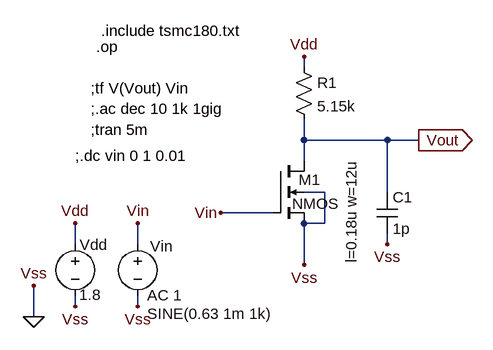
[diagram p0: schematic CS_amp.asc]
CS_amp.asc, the LTspice schematic file:
Version 4
SHEET 1 1056 680
WIRE 496 -64 496 -80
WIRE 496 48 496 16
WIRE 624 48 496 48
WIRE 672 48 624 48
WIRE 496 80 496 48
WIRE 528 128 496 128
WIRE 624 128 624 48
WIRE 448 160 368 160
WIRE 528 176 528 128
WIRE 528 176 496 176
WIRE 144 208 144 176
WIRE 240 208 240 176
WIRE 624 208 624 192
WIRE 496 240 496 176
WIRE 144 304 144 288
WIRE 240 304 240 288
WIRE 80 320 80 272
FLAG 80 320 0
FLAG 80 272 Vss
FLAG 240 176 Vin
FLAG 144 304 Vss
FLAG 240 304 Vss
FLAG 144 176 Vdd
FLAG 496 -80 Vdd
FLAG 496 240 Vss
FLAG 672 48 Vout
IOPIN 672 48 Out
FLAG 624 208 Vss
FLAG 368 160 Vin
SYMBOL nmos4 448 80 R0
WINDOW 0 40 29 Left 2
WINDOW 3 30 66 Left 2
WINDOW 123 121 -2 VRight 2
SYMATTR InstName M1
SYMATTR Value2 l=0.18u w=12u
SYMBOL voltage 144 192 R0
WINDOW 123 0 0 Left 0
WINDOW 39 0 0 Left 0
WINDOW 0 7 17 Left 2
WINDOW 3 6 94 Left 2
SYMATTR InstName Vdd
SYMATTR Value 1.8
SYMBOL voltage 240 192 R0
WINDOW 0 19 19 Left 2
WINDOW 3 15 123 Left 2
WINDOW 123 15 95 Left 2
WINDOW 39 0 0 Left 0
SYMATTR InstName Vin
SYMATTR Value SINE(0.63 1m 1k)
SYMATTR Value2 AC 1
SYMBOL res 480 -80 R0
SYMATTR InstName R1
SYMATTR Value 5.15k
SYMBOL cap 608 128 R0
SYMATTR InstName C1
SYMATTR Value 1p
TEXT 184 -120 Left 2 !.include tsmc180.txt
TEXT 176 -96 Left 2 !.op
TEXT 168 -32 Left 2 !;tf V(Vout) Vin
TEXT 168 0 Left 2 !;.ac dec 10 1k 1gig
TEXT 168 32 Left 2 !;tran 5m
TEXT 144 72 Left 2 !;.dc vin 0 1 0.01

The netlist it stands for:
* CS_amp.asc
M1 Vout Vin 0 0 NMOS l=0.18u w=12u
Vdd Vdd 0 1.8
Vin Vin 0 SINE(0.63 1m 1k) AC 1
R1 Vdd Vout 5.15k
C1 Vout 0 1p
.model NMOS NMOS
.model PMOS PMOS
.lib standard.mos
.include tsmc180.txt
.op
;tf V(Vout) Vin
;.ac dec 10 1k 1gig
;tran 5m
;.dc vin 0 1 0.01
.backanno
.end